# Altium schematic sheet dac-digital.SchDoc: DAC - Digital
size Letter; CheckedBy: J. Brinton; CompanyName: Signal Laboratories, Inc.; DrawnBy: J. Brinton; Engineer: J. Brinton; Address1: 3479 Edison Way; Address2: Menlo Park CA 94025; Address3: +1 (877) 778-8435; Address4: siglabs.com; Revision: 3; SheetNumber: 25; SheetTotal: 49
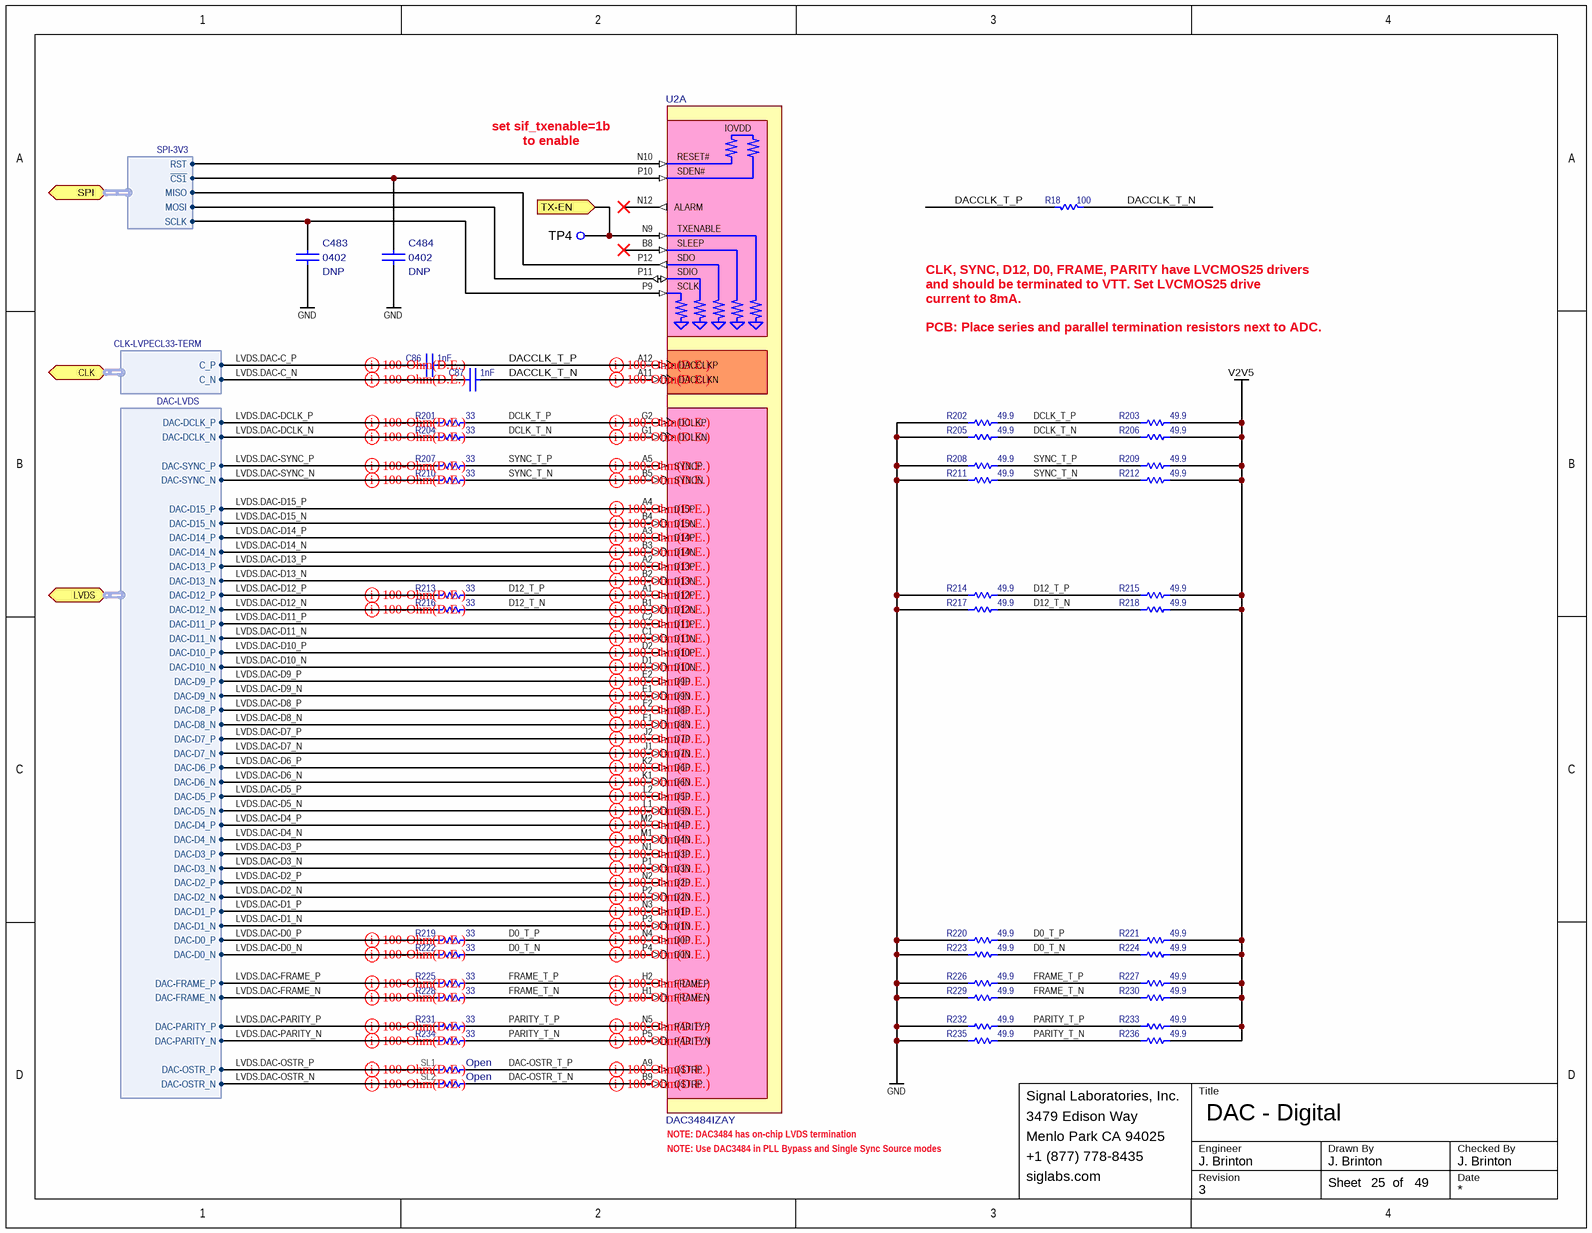
[diagram p0: dac-digital.SchDoc]

## Parts
C86  value 1nF  [CAPC100X50X55L25N]  (hidden comment: CGA2B2NP01H102J050BA)
C87  value 1nF  [CAPC100X50X55L25N]  (hidden comment: CGA2B2NP01H102J050BA)
C483  Package: 0402  Do Not Place: DNP  [CAPC100X50X55L25N]  (hidden comment: VJ0402A101KXA)
C484  Package: 0402  Do Not Place: DNP  [CAPC100X50X55L25N]  (hidden comment: VJ0402A101KXA)
R18  value 100  [RESC1005X40N]  (hidden comment: ERA-2AEB101X)
R201  value 33  [RESC1005X40N]  (hidden comment: MCS04020C3309FE000)
R202  value 49.9  [RESC1005X40N]  (hidden comment: MCS04020C4999FE000)
R203  value 49.9  [RESC1005X40N]  (hidden comment: MCS04020C4999FE000)
R204  value 33  [RESC1005X40N]  (hidden comment: MCS04020C3309FE000)
R205  value 49.9  [RESC1005X40N]  (hidden comment: MCS04020C4999FE000)
R206  value 49.9  [RESC1005X40N]  (hidden comment: MCS04020C4999FE000)
R207  value 33  [RESC1005X40N]  (hidden comment: MCS04020C3309FE000)
R208  value 49.9  [RESC1005X40N]  (hidden comment: MCS04020C4999FE000)
R209  value 49.9  [RESC1005X40N]  (hidden comment: MCS04020C4999FE000)
R210  value 33  [RESC1005X40N]  (hidden comment: MCS04020C3309FE000)
R211  value 49.9  [RESC1005X40N]  (hidden comment: MCS04020C4999FE000)
R212  value 49.9  [RESC1005X40N]  (hidden comment: MCS04020C4999FE000)
R213  value 33  [RESC1005X40N]  (hidden comment: MCS04020C3309FE000)
R214  value 49.9  [RESC1005X40N]  (hidden comment: MCS04020C4999FE000)
R215  value 49.9  [RESC1005X40N]  (hidden comment: MCS04020C4999FE000)
R216  value 33  [RESC1005X40N]  (hidden comment: MCS04020C3309FE000)
R217  value 49.9  [RESC1005X40N]  (hidden comment: MCS04020C4999FE000)
R218  value 49.9  [RESC1005X40N]  (hidden comment: MCS04020C4999FE000)
R219  value 33  [RESC1005X40N]  (hidden comment: MCS04020C3309FE000)
R220  value 49.9  [RESC1005X40N]  (hidden comment: MCS04020C4999FE000)
R221  value 49.9  [RESC1005X40N]  (hidden comment: MCS04020C4999FE000)
R222  value 33  [RESC1005X40N]  (hidden comment: MCS04020C3309FE000)
R223  value 49.9  [RESC1005X40N]  (hidden comment: MCS04020C4999FE000)
R224  value 49.9  [RESC1005X40N]  (hidden comment: MCS04020C4999FE000)
R225  value 33  [RESC1005X40N]  (hidden comment: MCS04020C3309FE000)
R226  value 49.9  [RESC1005X40N]  (hidden comment: MCS04020C4999FE000)
R227  value 49.9  [RESC1005X40N]  (hidden comment: MCS04020C4999FE000)
R228  value 33  [RESC1005X40N]  (hidden comment: MCS04020C3309FE000)
R229  value 49.9  [RESC1005X40N]  (hidden comment: MCS04020C4999FE000)
R230  value 49.9  [RESC1005X40N]  (hidden comment: MCS04020C4999FE000)
R231  value 33  [RESC1005X40N]  (hidden comment: MCS04020C3309FE000)
R232  value 49.9  [RESC1005X40N]  (hidden comment: MCS04020C4999FE000)
R233  value 49.9  [RESC1005X40N]  (hidden comment: MCS04020C4999FE000)
R234  value 33  [RESC1005X40N]  (hidden comment: MCS04020C3309FE000)
R235  value 49.9  [RESC1005X40N]  (hidden comment: MCS04020C4999FE000)
R236  value 49.9  [RESC1005X40N]  (hidden comment: MCS04020C4999FE000)
SL1  Notes: Open  [SOLDERLINK0603X26N]  (hidden comment: SOLDER_LINK)  (no BOM)
SL2  Notes: Open  [SOLDERLINK0603X26N]  (hidden comment: SOLDER_LINK)  (no BOM)
TP4  TEST_POINT_SMD_10  [TEST_POINT_SMD_10]  (value not drawn)  (no BOM)
U2  DAC3484IZAY  [ZAY-BGA-196]  (part A of 5)

## Ports
CLK (harness CLK-LVPECL33-TERM), LVDS (harness DAC-LVDS), SPI (harness SPI-3V3), TX-EN (in)

## Harnesses
DAC-LVDS: DAC-D0_P, DAC-D0_N, DAC-D1_P, DAC-D1_N, DAC-D2_P, DAC-D2_N, DAC-D3_P, DAC-D3_N, DAC-D4_P, DAC-D4_N, DAC-D5_P, DAC-D5_N, DAC-D6_P, DAC-D6_N, DAC-D7_P, DAC-D7_N, DAC-D8_P, DAC-D8_N, DAC-D9_P, DAC-D9_N, DAC-D10_P, DAC-D10_N, DAC-D11_P, DAC-D11_N, DAC-D12_P, DAC-D12_N, DAC-D13_P, DAC-D13_N, DAC-D14_P, DAC-D14_N, DAC-D15_P, DAC-D15_N, DAC-DCLK_P, DAC-DCLK_N, DAC-SYNC_P, DAC-SYNC_N, DAC-PARITY_P, DAC-PARITY_N, DAC-FRAME_P, DAC-FRAME_N, DAC-OSTR_P, DAC-OSTR_N
CLK-LVPECL33-TERM: C_P, C_N
SPI-3V3: MOSI, MISO, SCLK, ~{CS1}, RST

## Nets
GND: C483.2 C484.2 R202.2 R205.2 R208.2 R211.2 R214.2 R217.2 R220.2 R223.2 R226.2 R229.2 R232.2 R235.2
V2V5: R203.1 R206.1 R209.1 R212.1 R215.1 R218.1 R221.1 R224.1 R227.1 R230.1 R233.1 R236.1
D0_T_N: R222.1 R223.1 R224.2 U2.P4(D0N)
D0_T_P: R219.1 R220.1 R221.2 U2.N4(D0P)
D12_T_N: R216.1 R217.1 R218.2 U2.B1(D12N)
D12_T_P: R213.1 R214.1 R215.2 U2.A1(D12P)
DAC-OSTR_T_N: SL2.1 U2.B9(OSTRP)
DAC-OSTR_T_P: SL1.1 U2.A9(OSTRP)
DACCLK_T_N: C87.1 R18.2 U2.A11(DACCLKN)
DACCLK_T_P: C86.1 R18.1 U2.A12(DACCLKP)
DCLK_T_N: R204.1 R205.1 R206.2 U2.G1(DCLKN)
DCLK_T_P: R201.1 R202.1 R203.2 U2.G2(DCLKP)
FRAME_T_N: R228.1 R229.1 R230.2 U2.H1(FRAMEN)
FRAME_T_P: R225.1 R226.1 R227.2 U2.H2(FRAMEP)
LVDS.DAC-C_N: C87.2 ; port CLK.C_N
LVDS.DAC-C_P: C86.2 ; port CLK.C_P
LVDS.DAC-D0_N: R222.2 ; port LVDS.DAC-D0_N
LVDS.DAC-D0_P: R219.2 ; port LVDS.DAC-D0_P
LVDS.DAC-D1_N: U2.P3(D1N) ; port LVDS.DAC-D1_N
LVDS.DAC-D1_P: U2.N3(D1P) ; port LVDS.DAC-D1_P
LVDS.DAC-D2_N: U2.P2(D2N) ; port LVDS.DAC-D2_N
LVDS.DAC-D2_P: U2.N2(D2P) ; port LVDS.DAC-D2_P
LVDS.DAC-D3_N: U2.P1(D3N) ; port LVDS.DAC-D3_N
LVDS.DAC-D3_P: U2.N1(D3P) ; port LVDS.DAC-D3_P
LVDS.DAC-D4_N: U2.M1(D4N) ; port LVDS.DAC-D4_N
LVDS.DAC-D4_P: U2.M2(D4P) ; port LVDS.DAC-D4_P
LVDS.DAC-D5_N: U2.L1(D5N) ; port LVDS.DAC-D5_N
LVDS.DAC-D5_P: U2.L2(D5P) ; port LVDS.DAC-D5_P
LVDS.DAC-D6_N: U2.K1(D6N) ; port LVDS.DAC-D6_N
LVDS.DAC-D6_P: U2.K2(D6P) ; port LVDS.DAC-D6_P
LVDS.DAC-D7_N: U2.J1(D7N) ; port LVDS.DAC-D7_N
LVDS.DAC-D7_P: U2.J2(D7P) ; port LVDS.DAC-D7_P
LVDS.DAC-D8_N: U2.F1(D8N) ; port LVDS.DAC-D8_N
LVDS.DAC-D8_P: U2.F2(D8P) ; port LVDS.DAC-D8_P
LVDS.DAC-D9_N: U2.E1(D9N) ; port LVDS.DAC-D9_N
LVDS.DAC-D9_P: U2.E2(D9P) ; port LVDS.DAC-D9_P
LVDS.DAC-D10_N: U2.D1(D10N) ; port LVDS.DAC-D10_N
LVDS.DAC-D10_P: U2.D2(D10P) ; port LVDS.DAC-D10_P
LVDS.DAC-D11_N: U2.C1(D11N) ; port LVDS.DAC-D11_N
LVDS.DAC-D11_P: U2.C2(D11P) ; port LVDS.DAC-D11_P
LVDS.DAC-D12_N: R216.2 ; port LVDS.DAC-D12_N
LVDS.DAC-D12_P: R213.2 ; port LVDS.DAC-D12_P
LVDS.DAC-D13_N: U2.B2(D13N) ; port LVDS.DAC-D13_N
LVDS.DAC-D13_P: U2.A2(D13P) ; port LVDS.DAC-D13_P
LVDS.DAC-D14_N: U2.B3(D14N) ; port LVDS.DAC-D14_N
LVDS.DAC-D14_P: U2.A3(D14P) ; port LVDS.DAC-D14_P
LVDS.DAC-D15_N: U2.B4(D15N) ; port LVDS.DAC-D15_N
LVDS.DAC-D15_P: U2.A4(D15P) ; port LVDS.DAC-D15_P
LVDS.DAC-DCLK_N: R204.2 ; port LVDS.DAC-DCLK_N
LVDS.DAC-DCLK_P: R201.2 ; port LVDS.DAC-DCLK_P
LVDS.DAC-FRAME_N: R228.2 ; port LVDS.DAC-FRAME_N
LVDS.DAC-FRAME_P: R225.2 ; port LVDS.DAC-FRAME_P
LVDS.DAC-OSTR_N: SL2.2 ; port LVDS.DAC-OSTR_N
LVDS.DAC-OSTR_P: SL1.2 ; port LVDS.DAC-OSTR_P
LVDS.DAC-PARITY_N: R234.2 ; port LVDS.DAC-PARITY_N
LVDS.DAC-PARITY_P: R231.2 ; port LVDS.DAC-PARITY_P
LVDS.DAC-SYNC_N: R210.2 ; port LVDS.DAC-SYNC_N
LVDS.DAC-SYNC_P: R207.2 ; port LVDS.DAC-SYNC_P
PARITY_T_N: R234.1 R235.1 R236.2 U2.P5(PARITYN)
PARITY_T_P: R231.1 R232.1 R233.2 U2.N5(PARITYP)
SYNC_T_N: R210.1 R211.1 R212.2 U2.B5(SYNCN)
SYNC_T_P: R207.1 R208.1 R209.2 U2.A5(SYNCP)
TX-EN: TP4.1 U2.N9(TXENABLE) ; port TX-EN
NetC483_1: C483.1 U2.P9(SCLK) ; port SPI.SCLK
NetC484_1: C484.1 U2.P10(~{SDEN}) ; port SPI.~{CS1}
NetU2_N10: U2.N10(~{RESET}) ; port SPI.RST
NetU2_P11: U2.P11(SDIO) ; port SPI.MOSI
NetU2_P12: U2.P12(SDO) ; port SPI.MISO

Not connected (* = marked no-connect by the designer): U2 B8(SLEEP)* N12(ALARM)*

## Layout directives
differential pair; net class z100diff12; Name: 100-Ohm(D.E.): D0_T_N, D0_T_P, D12_T_N, D12_T_P, DAC-OSTR_T_N, DAC-OSTR_T_P, DACCLK_T_N, DACCLK_T_P, DCLK_T_N, DCLK_T_P, FRAME_T_N, FRAME_T_P, LVDS.DAC-C_N, LVDS.DAC-C_P, LVDS.DAC-D13_N, LVDS.DAC-D13_P, LVDS.DAC-D14_N, LVDS.DAC-D14_P, LVDS.DAC-D15_N, LVDS.DAC-D15_P, PARITY_T_N, PARITY_T_P, SYNC_T_N, SYNC_T_P
differential pair; net class z100diff12; Name: 100-Ohm(D.E.); net class dac: LVDS.DAC-D0_N, LVDS.DAC-D0_P, LVDS.DAC-D1_N, LVDS.DAC-D1_P, LVDS.DAC-D2_N, LVDS.DAC-D2_P, LVDS.DAC-D3_N, LVDS.DAC-D3_P, LVDS.DAC-D4_N, LVDS.DAC-D4_P, LVDS.DAC-D5_N, LVDS.DAC-D5_P, LVDS.DAC-D6_N, LVDS.DAC-D6_P, LVDS.DAC-D7_N, LVDS.DAC-D7_P, LVDS.DAC-D8_N, LVDS.DAC-D8_P, LVDS.DAC-D9_N, LVDS.DAC-D9_P, LVDS.DAC-D10_N, LVDS.DAC-D10_P, LVDS.DAC-D11_N, LVDS.DAC-D11_P, LVDS.DAC-D12_N, LVDS.DAC-D12_P, LVDS.DAC-DCLK_N, LVDS.DAC-DCLK_P, LVDS.DAC-FRAME_N, LVDS.DAC-FRAME_P, LVDS.DAC-OSTR_N, LVDS.DAC-OSTR_P, LVDS.DAC-PARITY_N, LVDS.DAC-PARITY_P, LVDS.DAC-SYNC_N, LVDS.DAC-SYNC_P

## Notes on the sheet
- set sif_txenable=1b
- to enable
- CLK, SYNC, D12, D0, FRAME, PARITY have LVCMOS25 drivers
- and should be terminated to VTT. Set LVCMOS25 drive
- current to 8mA.
- PCB: Place series and parallel termination resistors next to ADC.
- (near U2) NOTE: DAC3484 has on-chip LVDS termination
- NOTE: Use DAC3484 in PLL Bypass and Single Sync Source modes
- Title
- Engineer
- Revision
- Drawn By
- Checked By
- Date
- Sheet
- of
- (in symbol DAC3484IZAY, part A) RESET#; SDEN#

## Library data of the parts
C86 C87 = CAP 0402: Ceramic Capacitor 1nF ±5% 50V NP0 0402; Manufacturer: TDK; Tr: -55:150; Voltage: 50V; Manufacturer P/N: CGA2B2NP01H102J050BA; Package: 0402; Tolerance: ±5%
C483 C484 = VJ0402A101JXA: Ceramic Capacitor 100pF ±10% 50V C0G 0402; Manufacturer: Vishay; Tr: -55:150; Manufacturer P/N: VJ0402A101KXA; Tolerance: ±10%; Value: 100pF; Voltage: 50V
R18 = RES 0402: Thin Film Resistor 100 ±0.1% 0402; Manufacturer: Panasonic; Tr: -55:155; Package: 0402; Manufacturer P/N: ERA-2AEB101X; Tolerance: ±0.1%
R201 R204 R207 R210 R213 R216 R219 R222 R225 R228 R231 R234 = RES 0603: Thin Film Resistor 33 Ohm ±1% 0402; Manufacturer: Vishay; Tr: -55:150; Package: 0402; Manufacturer P/N: MCS04020C3309FE000; Do Not Place: *; Tolerance: ±1%
R202 R203 R205 R206 R208 R209 R211 R212 R214 R215 R217 R218 R220 R221 R223 R224 R226 R227 R229 R230 R232 R233 R235 R236 = RES 0603: Thin Film Resistor 49.9 Ohm ±1% 0402; Manufacturer: Vishay; Tr: -55:150; Package: 0402; Manufacturer P/N: MCS04020C4999FE000; Do Not Place: *; Tolerance: ±1%
SL1 SL2 = RES: Solder Link, Open
TP4 = TEST_POINT_SMD_10: Test Point SMD
U2 = DAC3484IZAY: High Speed Quad DAC, 16-bit, 1.25GSPS; Manufacturer: Texas Instruments; Manufacturer P/N: DAC3484IZAY